# EasyEDA Pro project hand-watch-pcb.epro

# Schematic Schematic1
Board Name: Board1; Create Date: 2025-10-27; Page Name: P1; Project Name: stm32f411ceu6-hand-watch; Schematic Name: Schematic1; Update Date: 2025-10-27; BladeWidth: 10; Company: 嘉立创EDA; Page Size: A4; RegionStart: 1; ShowBorder: 1; TitleBlock: 1; TitleBlockPosition: 3; Version: V1.0; XRegionCount: 6; YRegionCount: 4
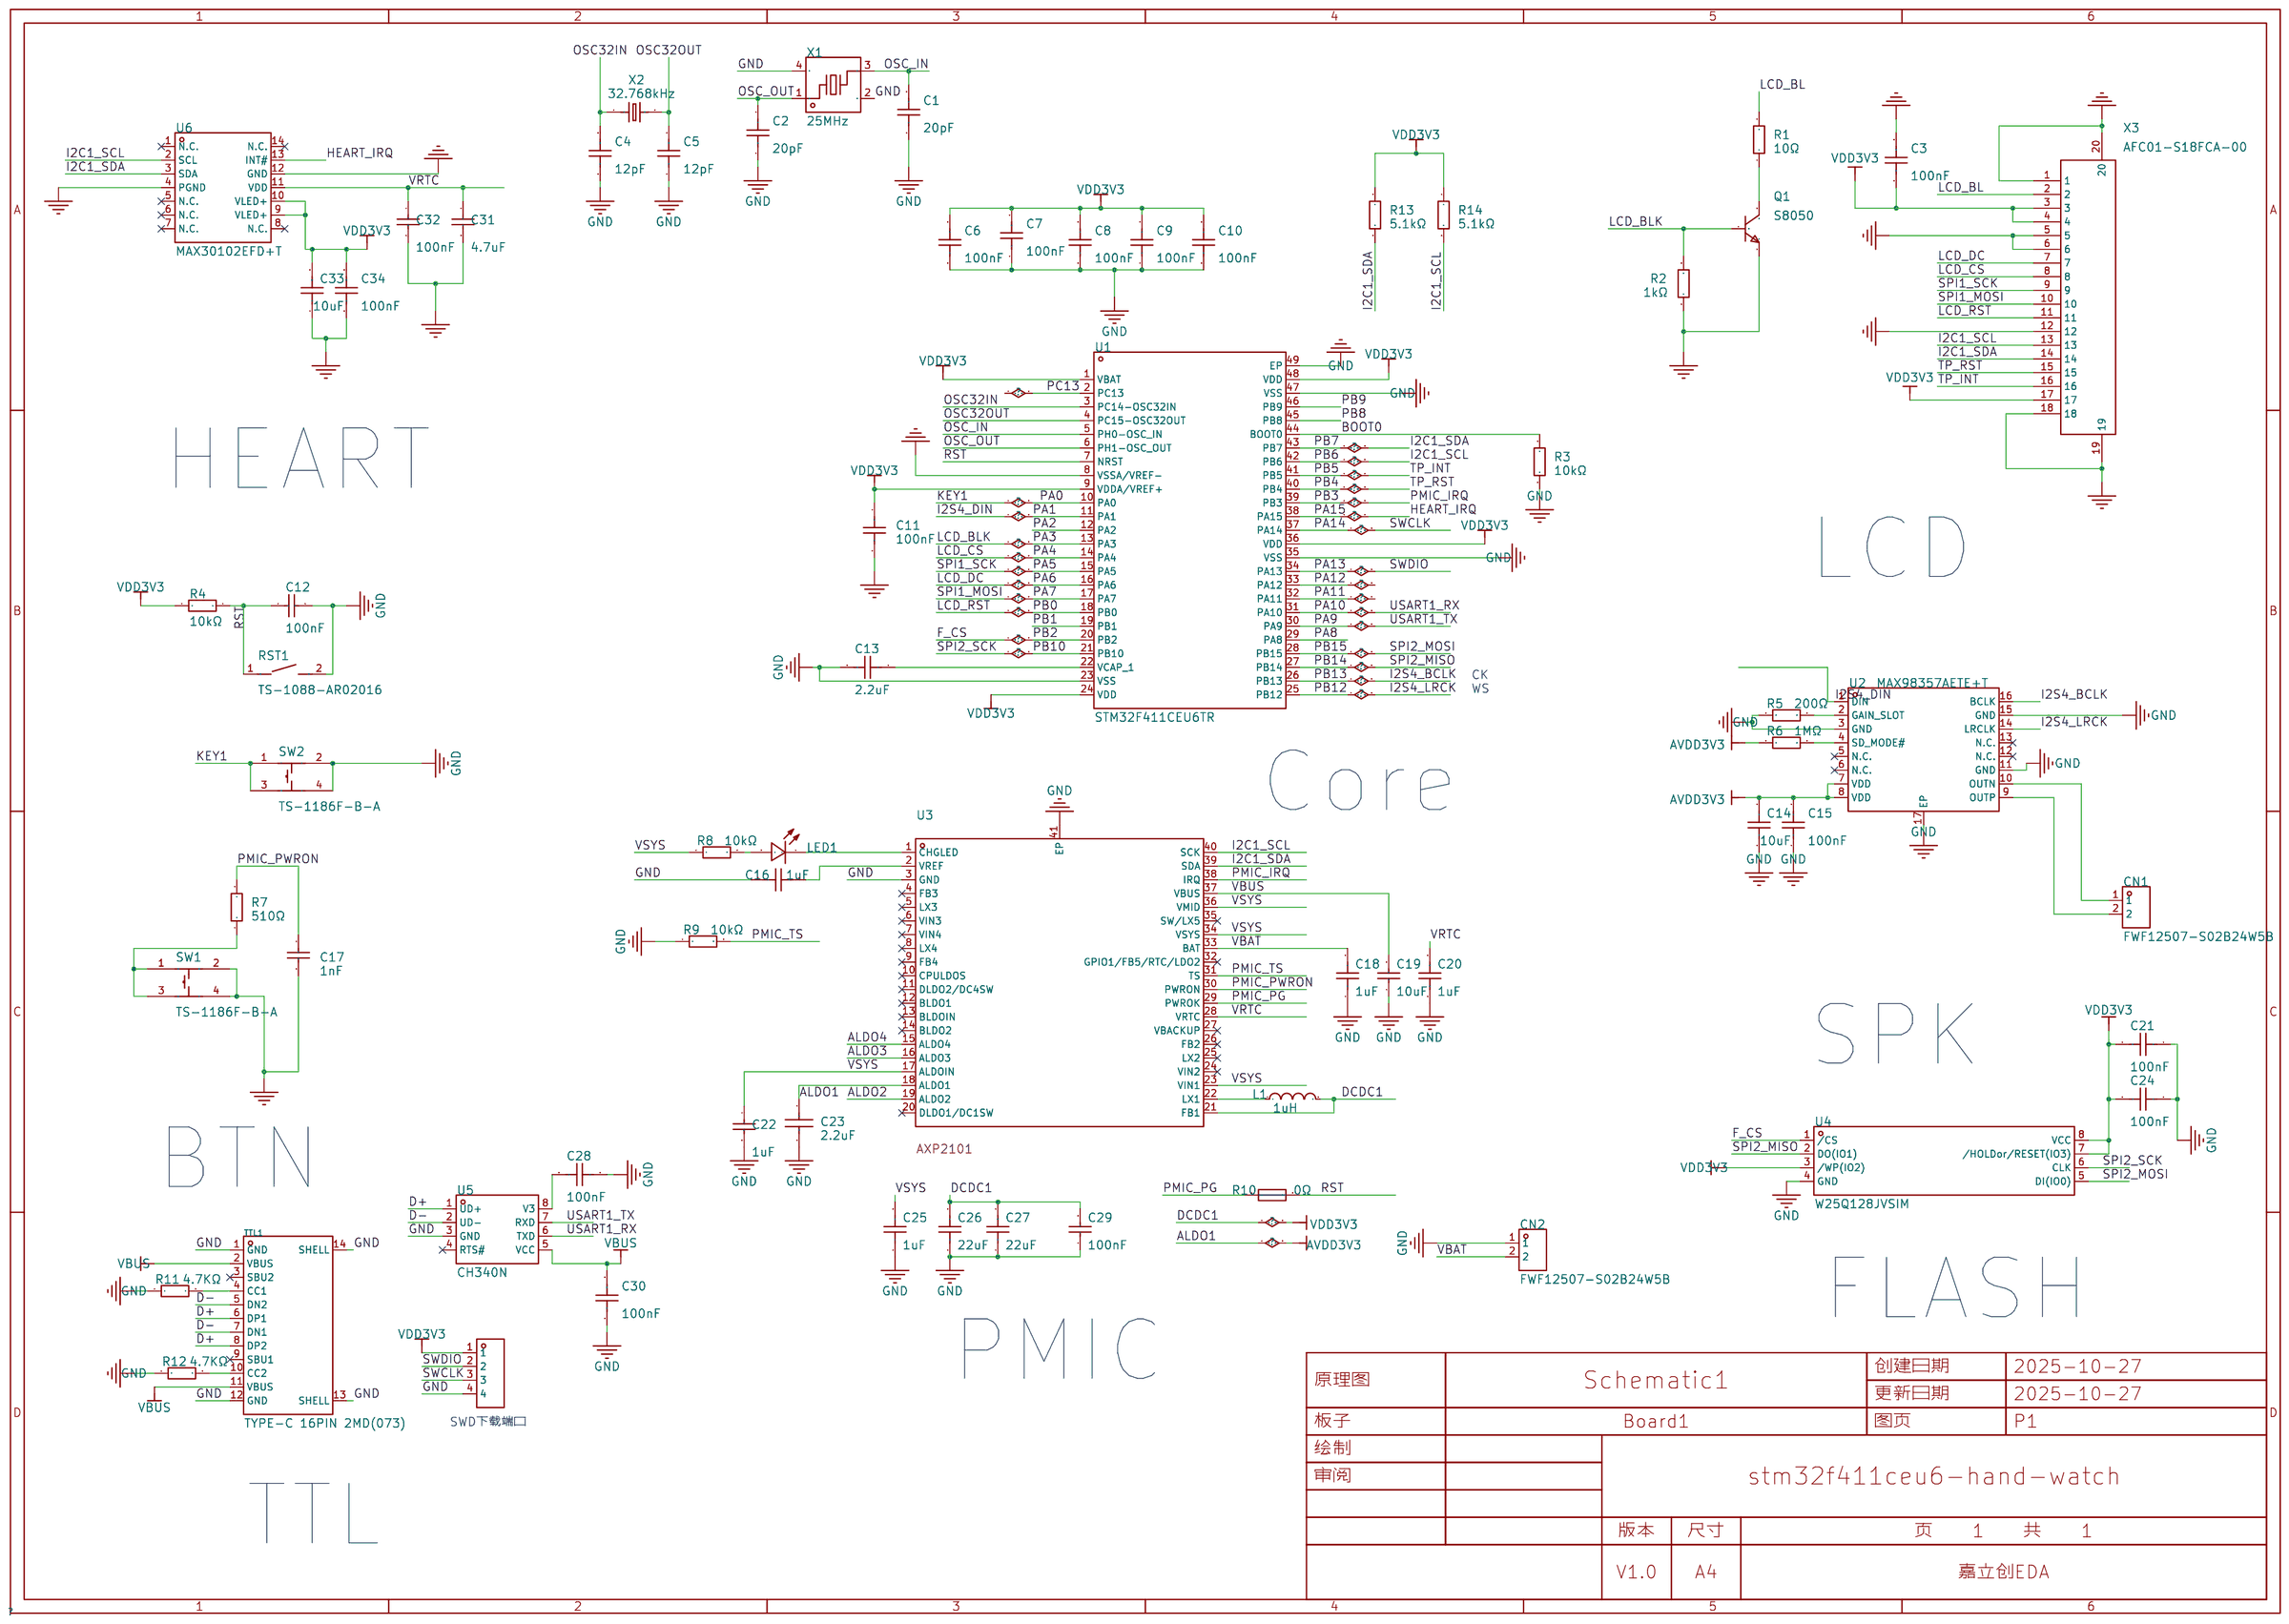
[diagram p0: schematic sheet]

## Parts
C1  20pF  [C0402]
C2  20pF  [C0402]
C3  100nF  [C0402]
C4  12pF  [C0402]
C5  12pF  [C0402]
C6  100nF  [C0402]
C7  100nF  [C0402]
C8  100nF  [C0402]
C9  100nF  [C0402]
C10  100nF  [C0402]
C11  100nF  [C0402]
C12  100nF  [C0402]
C13  2.2uF  [C0402]
C14  10uF  [C0603]
C15  100nF  [C0402]
C16  1uF  [C0402]
C17  1nF  [C0402]
C18  1uF  [C0402]
C19  10uF  [C0402]
C20  1uF  [C0402]
C21  100nF  [C0402]
C22  1uF  [C0402]
C23  2.2uF  [C0402]
C24  100nF  [C0402]
C25  1uF  [C0402]
C26  22uF  [C0603]
C27  22uF  [C0603]
C28  100nF  [C0402]
C29  100nF  [C0402]
C30  100nF  [C0402]
C31  4.7uF  [C0402]
C32  100nF  [C0402]
C33  10uF  [C0603]
C34  100nF  [C0402]
CN1  FWF12507-S02B24W5B  [CONN-TH_FWF12507-S02B24W5B]
CN2  FWF12507-S02B24W5B  [CONN-TH_FWF12507-S02B24W5B]
H1  PZ254R-11-04P  [HDR-TH_4P-P2.54-H-M-W10.4]
L1  1uH  [IND-SMD_L2.5-W2.0_WPN252012H]  (no BOM)
LED1  KT-0603R  [LED0603-RD]
Q1  S8050  [SOT-23-3_L2.9-W1.3-P1.90-LS2.3-BR]
R1  10Ω  [R0402]
R2  1kΩ  [R0402]
R3  10kΩ  [R0402]
R4  10kΩ  [R0402]
R5  200Ω  [R0402]
R6  1MΩ  [R0402]
R7  510Ω  [R0402]
R8  10kΩ  [R0402]
R9  10kΩ  [R0402]
R10  0Ω  [R0402]
R11  4.7KΩ  [R0402]
R12  4.7KΩ  [R0402]
R13  5.1kΩ  [R0402]
R14  5.1kΩ  [R0402]
RST1  TS-1088-AR02016  [SW-SMD_L3.9-W3.0-P4.45]
SW1  TS-1186F-B-A  [KEY-SMD_TS-1186F-C-A]
SW2  TS-1186F-B-A  [KEY-SMD_TS-1186F-C-A]
TTL1  TYPE-C 16PIN 2MD(073)  [USB-C-SMD_TYPE-C-6PIN-2MD-073]
U1  STM32F411CEU6TR  [UFQFPN-48_L7.0-W7.0-P0.50-BL-EP5.6]
U2  MAX98357AETE+T  [TQFN-16_L3.0-W3.0-P0.50-BL-EP1.5]
U3  -  [QFN-40_L5.0-W5.0-P0.40-TL-EP3.4]
U4  W25Q128JVSIM  [SOIC-8_L5.2-W5.2-P1.27-LS7.9-BL]
U5  CH340N  [SOP-8_L4.9-W3.9-P1.27-LS6.0-BL]
U6  MAX30102EFD+T  [OESIP-14_L5.6-W3.3-P0.80-TL]
X1  25MHz  [CRYSTAL-SMD_4P-L3.2-W2.5-BL]
X2  32.768kHz  [OSC-SMD_L3.2-W1.5]
X3  AFC01-S18FCA-00  [FPC-SMD_18P-P0.50_JS_AFC01-S18FCA-00]

## Library data of the parts
C1-C11 C13 C15 C21 C24 C28 C30 C34 = CAP_0402: Supplier Footprint: 0402
C12 C29 = CL05B104KO5NNNC: 容值:100nF;精度:±10%;额定电压:16V;材质(温度系数):X7R;; LCSC Part Name: 100nF ±10% 16V; Supplier Part: C1525; Manufacturer: SAMSUNG(三星); Supplier Footprint: 0402; JLCPCB Part Class: Basic Part; Datasheet: https://atta.szlcsc.com/upload/public/pdf/source/20160103/1457707674891.pdf; Supplier: LCSC; Tolerance: ±10%; Voltage Rated: 16V; Temperature Coefficient: X7R
C14 C33 = CAP_0603: Supplier Footprint: 0603
C16 C18 C20 C25 = CL05A105KA5NQNC: 容值:1uF;精度:±10%;额定电压:25V;材质(温度系数):X5R;; LCSC Part Name: 1uF ±10% 25V; Supplier Part: C52923; Manufacturer: SAMSUNG(三星); Supplier Footprint: 0402; JLCPCB Part Class: 基础库; Datasheet: https://atta.szlcsc.com/upload/public/pdf/source/20160103/1457707735223.pdf; Supplier: LCSC; Tolerance: ±10%; Voltage Rated: 25V; Temperature Coefficient: X5R
C17 = 0402B102K500NT: 容值:1nF;精度:±10%;额定电压:50V;材质(温度系数):X7R;; LCSC Part Name: 1nF ±10% 50V; Supplier Part: C1523; Manufacturer: FH(风华); Supplier Footprint: 0402; Datasheet: https://atta.szlcsc.com/upload/public/pdf/source/20200305/C486355_26A10D38EF8C2A5C37091D0039909270.pdf; Supplier: LCSC; Tolerance: ±10%; Voltage Rated: 50V; Temperature Coefficient: X7R
C19 = CL05A106MQ5NUNC: 容值:10uF;精度:±20%;额定电压:6.3V;材质(温度系数):X5R;; LCSC Part Name: 10uF ±20% 6.3V; Supplier Part: C15525; Manufacturer: SAMSUNG(三星); Supplier Footprint: 0402; JLCPCB Part Class: 基础库; Datasheet: https://atta.szlcsc.com/upload/public/pdf/source/20220823/2B02EE04F8F211D38A52DCB16EB6BEBA.pdf; Supplier: LCSC; Tolerance: ±20%; Voltage Rated: 6.3V; Temperature Coefficient: X5R
C22 = CL05B104KO5NNNC: 容值:100nF;精度:±10%;额定电压:16V;材质(温度系数):X7R;; LCSC Part Name: 100nF ±10% 16V; Supplier Part: C52923; Manufacturer: SAMSUNG(三星); Manufacturer Part: CL05A105KA5NQNC; Supplier Footprint: 0402; JLCPCB Part Class: Basic Part; Datasheet: https://atta.szlcsc.com/upload/public/pdf/source/20160103/1457707674891.pdf; Supplier: LCSC; Tolerance: ±10%; Voltage Rated: 16V; Temperature Coefficient: X7R; Check: true
C23 = CL05A225MQ5NSNC: 容值:2.2uF;精度:±20%;额定电压:6.3V;材质(温度系数):X5R;; LCSC Part Name: 2.2uF ±20% 6.3V; Supplier Part: C12530; Manufacturer: SAMSUNG(三星); Supplier Footprint: 0402; JLCPCB Part Class: 基础库; Datasheet: https://atta.szlcsc.com/upload/public/pdf/source/20160218/1457707763339.pdf; Supplier: LCSC; Tolerance: ±20%; Voltage Rated: 6.3V; Temperature Coefficient: X5R
C26 C27 = CL10A226MQ8NRNC: 容值:22uF;精度:±20%;额定电压:6.3V;材质(温度系数):X5R;; LCSC Part Name: 22uF ±20% 6.3V; Supplier Part: C59461; Manufacturer: SAMSUNG(三星); Supplier Footprint: 0603; JLCPCB Part Class: 基础库; Datasheet: https://atta.szlcsc.com/upload/public/pdf/source/20160103/1457707740762.pdf; Supplier: LCSC; Tolerance: ±20%; Voltage Rated: 6.3V; Temperature Coefficient: X5R
C31 C32 = CL05B104KO5NNNC: 容值:100nF;精度:±10%;额定电压:16V;材质(温度系数):X7R;; LCSC Part Name: 100nF ±10% 16V; Supplier Part: C1525; Manufacturer: SAMSUNG(三星); Manufacturer Part: CL05A105KA5NQNC; Supplier Footprint: 0402; JLCPCB Part Class: Basic Part; Datasheet: https://atta.szlcsc.com/upload/public/pdf/source/20160103/1457707674891.pdf; Supplier: LCSC; Tolerance: ±10%; Voltage Rated: 16V; Temperature Coefficient: X7R; Check: true
CN1 CN2 = FWF12507-S02B24W5B: 插针结构:1x2P;间距:1.25mm;安装方式:弯插;参考系列:-;总PIN数:2P;排数:1;每排PIN数:2;行距:-;额定电流:1A;工作温度范围:-25℃~+85℃;; Supplier Part: C2834209; Manufacturer: TXGA(特思嘉); Supplier Footprint: 弯插,P=1.25mm; JLCPCB Part Class: 扩展库; Datasheet: https://atta.szlcsc.com/upload/public/pdf/source/20210519/C2834209_D704536955647AE3B393E8393E63EA83.pdf; Supplier: LCSC; Pins Structure: 1x2P; Pitch: 1.25mm; Mounting Style: 弯插; Number of Pins: 2P; Number of Rows: 1; Number of PINs Per Row: 2; Current Rating (Max): 1A; Operating Temperature Range: -25℃~+85℃
H1 = PZ254R-11-04P: 间距:2.54mm;总PIN位数:4;排数:1;插针结构:1x4P;行距:-;安装类型:弯插;圆针/方针:方针;额定电流:-;额定电压:-;配合针长度:6mm;塑高:2.5mm;触头材质:黄铜;触头镀层:-;工作温度范围:-40℃~+105℃;颜色:黑色;; LCSC Part Name: 2.54mm 1x4P 弯插 方针; Supplier Part: C492412; Manufacturer: XFCN(兴飞); Supplier Footprint: 插件,P=2.54mm; JLCPCB Part Class: 扩展库; Supplier: LCSC; Pitch: 2.54mm; Number of Pins: 4; Number of Rows: 1; Pin Structure: 1x4P; Mounting Type: 弯插; Circluar Pins/Square Pins: 方针; Length of Mating Pin: 6mm; Insulation Height: 2.5mm; Contact Material: 黄铜; Operating Temperature Range: -40℃~+105℃; Color: 黑色
L1 = WPN252012H1R0MT: 电感值:1uH;精度:±20%;额定电流:3A;直流电阻(DCR):54mΩ;; LCSC Part Name: 1uH ±20% 3A 54mΩ; Supplier Part: C98348; Manufacturer: Sunlord(顺络); Supplier Footprint: SMD; JLCPCB Part Class: 扩展库; Datasheet: https://atta.szlcsc.com/upload/public/pdf/source/20210916/5D33DED32780FEB7D0AA8BED8FC93477.pdf; Supplier: LCSC; Tolerance: ±20%; Rated Current: 3A; DC Resistance (DCR): 54mΩ
LED1 = KT-0603R: 发光颜色:红色;功率:-;正向电流:-;主波长:-;二极管配置:-;透镜颜色:-;色温:-;发光角度:-;载带方式:-;工作温度:-40℃~+85℃;; LCSC Part Name: 0603 红灯 高亮; Supplier Part: C2286; Manufacturer: KENTO; Supplier Footprint: 0603; JLCPCB Part Class: 基础库; Datasheet: https://atta.szlcsc.com/upload/public/pdf/source/20160616/1466072038404.pdf; Supplier: LCSC; Emitted Color: 红色; Operating Temperature: -40℃~+85℃
Q1 = S8050_C20069125: 晶体管类型:NPN;集电极电流(Ic):500mA;集射极击穿电压(Vceo):25V;耗散功率(Pd):300mW;直流电流增益(hFE):120@50mA,1.0V;; LCSC Part Name: hFE:200-350，丝印:J3Y S8050; Supplier Part: C20069125; Manufacturer: 宏嘉诚; Supplier Footprint: SOT-23; JLCPCB Part Class: 扩展库; Datasheet: https://atta.szlcsc.com/upload/public/pdf/source/20250624/73EDA2AB79795B2EF6617BE5A1B52BD3.pdf; Supplier: LCSC; type: NPN; Current - Collector(Ic): 500mA; Collector - Emitter Voltage VCEO: 25V; Pd - Power Dissipation: 300mW; DC Current Gain: 120@50mA,1.0V; Transition frequency(fT): 100MHz; Current - Collector Cutoff: 100nA; Vce Saturation(VCE(sat)): 600mV@500mA,50mA; Operating Temperature: -55℃~+150℃; Emitter-Base Voltage(Vebo): 5V
R1 = 0402WGF100JTCE: 电阻类型:厚膜电阻;阻值:10Ω;精度:±1%;功率:62.5mW;温度系数:±200ppm/℃;; LCSC Part Name: 厚膜电阻 10Ω ±1% 62.5mW; Supplier Part: C25077; Manufacturer: UNI-ROYAL(厚声); Supplier Footprint: 0402; Datasheet: https://atta.szlcsc.com/upload/public/pdf/source/20200306/C422600_1E6D84923E4A46A82E41ADD87F860B5C.pdf; Supplier: LCSC; Type: 厚膜电阻; Tolerance: ±1%; Power(Watts): 62.5mW; Temperature Coefficient: ±200ppm/℃; Overload Voltage (Max): 50V; Operating Temperature Range: -55℃~+155℃; Check: true
R2 = 0402WGF1002TCE: 电阻类型:厚膜电阻;阻值:10kΩ;精度:±1%;功率:62.5mW;; LCSC Part Name: 10kΩ ±1% 62.5mW; Supplier Part: C25744; Manufacturer: UNI-ROYAL(厚声); Supplier Footprint: 0402; JLCPCB Part Class: 基础库; Datasheet: https://atta.szlcsc.com/upload/public/pdf/source/20200306/C422600_1E6D84923E4A46A82E41ADD87F860B5C.pdf; Supplier: LCSC; Type: 厚膜电阻; Tolerance: ±1%; Power(Watts): 62.5mW; Temperature Coefficient: ±100ppm/℃; Overload Voltage (Max): 50V; Operating Temperature Range: -55℃~+155℃; Check: true
R3-R6 R8 R9 R11-R14 = 0402WGF1002TCE: 电阻类型:厚膜电阻;阻值:10kΩ;精度:±1%;功率:62.5mW;; LCSC Part Name: 10kΩ ±1% 62.5mW; Supplier Part: C25744; Manufacturer: UNI-ROYAL(厚声); Supplier Footprint: 0402; JLCPCB Part Class: 基础库; Datasheet: https://atta.szlcsc.com/upload/public/pdf/source/20200306/C422600_1E6D84923E4A46A82E41ADD87F860B5C.pdf; Supplier: LCSC; Type: 厚膜电阻; Tolerance: ±1%; Power(Watts): 62.5mW; Temperature Coefficient: ±100ppm/℃; Overload Voltage (Max): 50V; Operating Temperature Range: -55℃~+155℃
R7 = 0402WGF5100TCE: 电阻类型:厚膜电阻;阻值:510Ω;精度:±1%;功率:62.5mW;最大工作电压:50V;温度系数:±100ppm/℃;; LCSC Part Name: 510Ω ±1% 62.5mW 厚膜电阻; Supplier Part: C25123; Manufacturer: UNI-ROYAL(厚声); Supplier Footprint: 0402; JLCPCB Part Class: 基础库; Datasheet: https://atta.szlcsc.com/upload/public/pdf/source/20200306/C422600_1E6D84923E4A46A82E41ADD87F860B5C.pdf; Supplier: LCSC; Type: 厚膜电阻; Tolerance: ±1%; Power(Watts): 62.5mW; Overload Voltage (Max): 50V; Temperature Coefficient: ±100ppm/℃; Operating Temperature Range: -55℃~+155℃
R10 = 0402WGF0000TCE: 电阻类型:厚膜电阻;阻值:0Ω;精度:±1%;功率:62.5mW;; LCSC Part Name: 0Ω ±1% 62.5mW; Supplier Part: C17168; Manufacturer: UNI-ROYAL(厚声); Supplier Footprint: 0402; Datasheet: https://atta.szlcsc.com/upload/public/pdf/source/20200306/C422600_1E6D84923E4A46A82E41ADD87F860B5C.pdf; Supplier: LCSC; Type: 厚膜电阻; Tolerance: ±1%; Power(Watts): 62.5mW; Temperature Coefficient: ±800ppm/℃; Overload Voltage (Max): 50V; Operating Temperature Range: -55℃~+155℃
RST1 = TS-1088-AR02016: 电路结构:单刀单掷;按钮形状:圆形按钮;作用力:160gf;安装方式:立贴;开关长度:4mm;开关宽度:3mm;开关高度:2mm;带支架:不带;触点电流:50mA;额定电压(DC):12V;绝缘电阻:100MΩ;机械寿命:10万次;; LCSC Part Name: 4*3*2mm 立贴 轻触开关; Supplier Part: C720477; Manufacturer: XUNPU(讯普); Supplier Footprint: SMD; JLCPCB Part Class: 基础库; Datasheet: https://atta.szlcsc.com/upload/public/pdf/source/20200810/C720475_60D09DD6C54279ADDB2DC25100F1CC11.pdf; Supplier: LCSC; Circuit: 单刀单掷; Actuator Style: 圆形按钮; Operating Force: 160gf; Mounting Style: 立贴; Switch Length: 4mm; Switch Width: 3mm; Switch Height: 2mm; Strike Gundam: 不带; Contact Current: 50mA; Voltage Rating (DC): 12V; Insulation Resistance: 100MΩ; Actuator/Cap Color: 黑色; Pin Style: SMD接片; Mechanical Life: 10万次; Operating Temperature: -30℃~+80℃
SW1 SW2 = TS-1186F-B-A: 电路结构:单刀单掷;按钮形状:矩形按钮;作用力:1.6N;安装方式:卧贴;开关长度:3.6mm;开关宽度:3.5mm;开关高度:3.6mm;带支架:不带支架;触点电流:50mA;额定电压:12V;带灯:无;工作寿命:10万次;; LCSC Part Name: 3.6*3.5*3.6mm 卧贴 轻触开关; Supplier Part: C908470; Manufacturer: XKB Connection(中国星坤); Supplier Footprint: SMD; Datasheet: https://item.szlcsc.com/datasheet/TS-1186F-B-A/975211.html; Supplier: LCSC; Circuit: 单刀单掷; Actuator Style: 矩形按钮; Operating Force: 1.6N; Mounting Type: 卧贴; Length: 3.6mm; Width: 3.5mm; Switch Height: 3.6mm; with Bracket: 不带支架; Contact Current: 50mA; Voltage Rating: 12V; Actuator/Cap Color: 黑色; With Lamp: 无; Life: 10万次; Operating Temperature: -30℃~+85℃
TTL1 = TYPE-C 16PIN 2MD(073): 连接器类型:Type-C;标准:-;公母:母座;触点数量:16;端口数量:1;安装方式:卧贴;额定电流 - 电源:5A;工作温度范围:-25℃~+85℃;; LCSC Part Name: TYPE-C母座 16P 4脚插件带定位柱 不锈钢外壳 2次模顶; Supplier Part: C2765186; Manufacturer: SHOU HAN(首韩); Supplier Footprint: SMD; JLCPCB Part Class: 扩展库; Supplier: LCSC; Connector Type: Type-C; Gender: 母座; Number of Contacts: 16; Number of Ports: 1; Mounting Style: 卧贴; Current Rating - Power (Max): 5A; Operating Temperature Range: -25℃~+85℃
U1 = STM32F411CEU6TR: CPU内核:ARM-M4;CPU最大主频:100MHz;应用领域:-;; LCSC Part Name: 带DSP和FPU的高性能基本型系列ARM Cortex-M4 MCU，具有512 KB Flash、100 MHz CPU和ART加速器; Supplier Part: C2054095; Manufacturer: ST(意法半导体); Supplier Footprint: UFQFPN-48(7x7); Datasheet: https://atta.szlcsc.com/upload/public/pdf/source/20210609/C2054095_D420176800F9A9DECA745BDC6F5392BE.pdf; Supplier: LCSC; CPU Core: ARM-M4; CPU Maximum Speed: 100MHz; Program Storage Size: 512KB; Program Memory Type: FLASH; Number of I/O: 36; ADC (Bit): 12bit; Voltage - Supply: 1.7V~3.6V
U2 = MAX98357AETE+T: 功放类型:-;扬声器通道数:单声道;输出功率:3.2Wx2@4Ω;; Supplier Part: C910544; Manufacturer: ADI(亚德诺)/MAXIM(美信); Supplier Footprint: TQFN-16-EP(3x3); JLCPCB Part Class: 扩展库; Datasheet: https://atta.szlcsc.com/upload/public/pdf/source/20210106/C910544_CB6DE4B2CEE254A72E6BDB40E718D281.pdf; Supplier: LCSC; Speaker Channels: 单声道; Output Power: 3.2Wx2@4Ω; Supply Voltage: 2.5V~5.5V; Operating Temperature: -40℃~+85℃
U3 = AXP2101: Supplier Part: C3036461; Manufacturer: Allwinner(全志); Supplier Footprint: QFN-40; Datasheet: https://atta.szlcsc.comnull; Supplier: LCSC
U4 = W25Q128JVSIM: Supplier Part: C2613930; Manufacturer: WINBOND(华邦); Supplier Footprint: SOIC-8-208mil; JLCPCB Part Class: Extended Part; Datasheet: https://atta.szlcsc.com/upload/public/pdf/source/20210412/84C68860639CE6E99E4DBE9DB39E5296.pdf; Supplier: LCSC
U5 = CH340N: LCSC Part Name: USB转串口芯片 CH340; Supplier Part: C2977777; Manufacturer: WCH(南京沁恒); Supplier Footprint: SOP-8; JLCPCB Part Class: 扩展库; Datasheet: https://atta.szlcsc.com/upload/public/pdf/source/20230530/6E401E9554E9F5311886CC8B3F89B62E.pdf; Supplier: LCSC
U6 = MAX30102EFD+T_C6454833: 用于可穿戴健康设备的高灵敏度脉搏血氧仪和心率传感器、用于健身和卫生保健领域的高灵敏度脉搏血氧仪和心率生物传感器; LCSC Part Name: 高灵敏度脉搏血氧仪和心率传感器; Supplier Part: C6454833; Manufacturer: ADI(亚德诺)/MAXIM(美信); Supplier Footprint: OESIP-14; JLCPCB Part Class: 扩展库; Datasheet: https://atta.szlcsc.com/upload/public/pdf/source/20230523/5357A0E2EBB238F1082B332F3131EA1A.pdf; Supplier: LCSC; Operating Temperature: -40℃~+85℃
X1 = XL2EL89CSI-111YLC-25M: 频率:25MHz;频率公差:±10ppm;负载电容:20pF;; LCSC Part Name: 25MHz ±10ppm 20pF YSX321SL; Supplier Part: C5280577; Manufacturer: YXC(扬兴晶振); Supplier Footprint: SMD3225-4P; JLCPCB Part Class: 扩展库; Datasheet: https://atta.szlcsc.com/upload/public/pdf/source/20221123/8DAA01809C4E3F159850A71277C18D74.pdf; Supplier: LCSC; Crystal Type: 贴片无源晶振; Frequency Tolerance: ±10ppm; Load Capacitance: 20pF
X2 = X321532768KGD2SI: 频率:32.768kHz;频率公差:±20ppm;负载电容:12.5pF;; LCSC Part Name: 32.768kHz ±20ppm 12.5pF YST310S; Supplier Part: C620155; Manufacturer: YXC(扬兴晶振); Supplier Footprint: SMD3215-2P; JLCPCB Part Class: Extended Part; Datasheet: https://atta.szlcsc.com/upload/public/pdf/source/20210329/C620155_E5A74FC0D27C5E9015A8D75DE9484FEA.pdf; Supplier: LCSC; Crystal Type: 贴片无源晶振; Frequency Tolerance: ±20ppm; Load Capacitance: 12.5pF; Operating Temperature: -40℃~+85℃
X3 = AFC01-S18FCA-00: 锁定特性:翻盖式;触点类型:下接;触点数量:18P;间距:0.5mm;安装类型:卧贴;工作温度范围:-;; LCSC Part Name: 间距:0.5mm P数:18P 翻盖式 下接; Supplier Part: C262666; Manufacturer: JS(钜硕电子); Supplier Footprint: SMD,P=0.5mm,卧贴; Datasheet: https://atta.szlcsc.com/upload/public/pdf/source/20190816/C413942_2A72D1AC756EAE17EEDF756A339D4500.pdf; Supplier: LCSC; Locking Feature: 翻盖式; Contact Type: 下接; Number of Contacts: 18P; Pitch: 0.5mm; Mounting Type: 卧贴; FFC, FCB Thickness: 0.3mm; Height Above Board: 2mm

## Nets
AVDD3V3: C14.2 C15.2 C23.2 R6.1 U2.7(VDD) U2.8(VDD) U3.18(ALDO1)
GND: C1.1 C2.1 C3.2 C4.1 C5.1 C6.1 C7.1 C8.1 C9.1 C10.1 C11.2 C12.1 C13.2 C14.1 C15.1 C16.1 C17.1 C18.1 C19.1 C20.1 C21.1 C22.2 C23.1 C24.1 C25.1 C26.1 C27.1 C28.1 C29.1 C30.1 C31.2 C32.2 C33.1 C34.1 CN2.1 H1.4 Q1.2(E) R2.1 R3.2 R5.1 R9.1 R11.1 R12.1 RST1.2 SW1.2 SW1.4 SW2.2 SW2.4 TTL1.1(GND) TTL1.12(GND) TTL1.13(SHELL) TTL1.14(SHELL) U1.8(VSSA/VREF-) U1.23(VSS) U1.35(VSS) U1.47(VSS) U1.49(EP) U2.3(GND) U2.11(GND) U2.15(GND) U2.17(EP) U3.3(GND) U3.41(EP) U4.4(GND) U5.3(GND) U6.4(PGND) U6.12(GND) X1.2(GND) X1.4(GND) X3.1 X3.5 X3.6 X3.12 X3.18 X3.19 X3.20
VBAT: C18.2 CN2.2 U3.33(BAT)
VBUS: C19.2 C30.2 TTL1.2(VBUS) TTL1.11(VBUS) U3.37(VBUS) U5.5(VCC)
VDD3V3: C3.1 C6.2 C7.2 C8.2 C9.2 C10.2 C11.1 C21.2 C24.2 C26.2 C27.2 C29.2 C33.2 C34.2 H1.1 L1.2 R4.2 R13.1 R14.1 U1.1(VBAT) U1.9(VDDA/VREF+) U1.24(VDD) U1.36(VDD) U1.48(VDD) U3.21(FB1) U4.3(/WP(IO2)) U4.7(/HOLDor/RESET(IO3)) U4.8(VCC) U6.9(VLED+) U6.10(VLED+) X3.3 X3.4 X3.17
ALDO2: U3.19(ALDO2)
ALDO3: U3.16(ALDO3)
ALDO4: U3.15(ALDO4)
BOOT0: R3.1 U1.44(BOOT0)
D+: TTL1.6(DP1) TTL1.8(DP2) U5.1(UD+)
D-: TTL1.5(DN2) TTL1.7(DN1) U5.2(UD-)
F_CS: U1.20(PB2) U4.1(/CS)
HEART_IRQ: U1.38(PA15) U6.13(INT#)
I2C1_SCL: R14.2 U1.42(PB6) U3.40(SCK) U6.2(SCL) X3.13
I2C1_SDA: R13.2 U1.43(PB7) U3.39(SDA) U6.3(SDA) X3.14
I2S4_BCLK: U1.26(PB13) U2.16(BCLK)
I2S4_DIN: U1.11(PA1) U2.1(DIN)
I2S4_LRCK: U1.25(PB12) U2.14(LRCLK)
KEY1: SW2.1 SW2.3 U1.10(PA0)
LCD_BL: R1.2 X3.2
LCD_BLK: Q1.1(B) R2.2 U1.13(PA3)
LCD_CS: U1.14(PA4) X3.8
LCD_DC: U1.16(PA6) X3.7
LCD_RST: U1.18(PB0) X3.11
OSC32IN: C4.2 U1.3(PC14-OSC32IN) X2.1
OSC32OUT: C5.2 U1.4(PC15-OSC32OUT) X2.2
OSC_IN: C1.2 U1.5(PH0-OSC_IN) X1.3
OSC_OUT: C2.2 U1.6(PH1-OSC_OUT) X1.1
PA2: U1.12(PA2)
PA5: U1.15(PA5) X3.9
PA7: U1.17(PA7) X3.10
PA8: U1.29(PA8)
PA9: U1.30(PA9) U5.7(RXD)
PA10: U1.31(PA10) U5.6(TXD)
PA11: U1.32(PA11)
PA12: U1.33(PA12)
PA13: H1.2 U1.34(PA13)
PA14: H1.3 U1.37(PA14)
PB1: U1.19(PB1)
PB3: U1.39(PB3) U3.38(IRQ)
PB4: U1.40(PB4) X3.15
PB5: U1.41(PB5) X3.16
PB8: U1.45(PB8)
PB9: U1.46(PB9)
PB10: U1.21(PB10) U4.6(CLK)
PB14: U1.27(PB14) U4.2(DO(IO1))
PB15: U1.28(PB15) U4.5(DI(IO0))
PC13: U1.2(PC13)
PMIC_PG: R10.1 U3.29(PWROK)
PMIC_PWRON: C17.2 R7.2 U3.30(PWRON)
PMIC_TS: R9.2 U3.31(TS)
RST: C12.2 R4.1 R10.2 RST1.1 U1.7(NRST)
VRTC: C20.2 C31.1 C32.1 U3.28(VRTC) U6.11(VDD)
VSYS: C22.1 C25.2 R8.1 U3.17(ALDOIN) U3.23(VIN1) U3.34(VSYS) U3.36(VMID)
$1N3644: C28.2 U5.8(V3)
$1N3653: R11.2 TTL1.4(CC1)
$1N3654: R12.2 TTL1.10(CC2)
$1N3730: R5.2 U2.2(GAIN_SLOT)
$1N3744: CN1.1 U2.10(OUTN)
$1N3745: CN1.2 U2.9(OUTP)
$1N3746: R6.2 U2.4(SD_MODE#)
$1N3823: C13.1 U1.22(VCAP_1)
$1N4450: Q1.3(C) R1.1
$1N5317: LED1.1(K) U3.1(CHGLED)
$1N5318: LED1.2(A) R8.2
$1N5323: C16.2 U3.2(VREF)
$1N5350: L1.1 U3.22(LX1)
Net-(R7-1): R7.1 SW1.1 SW1.3

Not connected (* = marked no-connect by the designer): TTL1 3(SBU2)* 9(SBU1)*; U2 5(N.C.)* 6(N.C.)* 12(N.C.)* 13(N.C.)*; U3 4(FB3)* 5(LX3)* 6(VIN3)* 7(VIN4)* 8(LX4)* 9(FB4)* 10(CPULDOS)* 11(DLDO2/DC4SW)* 12(BLDO1)* 13(BLDOIN)* 14(BLDO2)* 20(DLDO1/DC1SW)* 24(VIN2)* 25(LX2)* 26(FB2)* 27(VBACKUP)* 32(GPIO1/FB5/RTC/LDO2)* 35(SW/LX5)*; U5 4(RTS#)*; U6 1(N.C.)* 5(N.C.)* 6(N.C.)* 7(N.C.)* 8(N.C.)* 14(N.C.)*

## Notes on the sheet
- HEART
- LCD
- CK
- WS
- Core
- SPK
- BTN
- FLASH
- PMIC
- SWD下载端口
- TTL

# Board PCB1
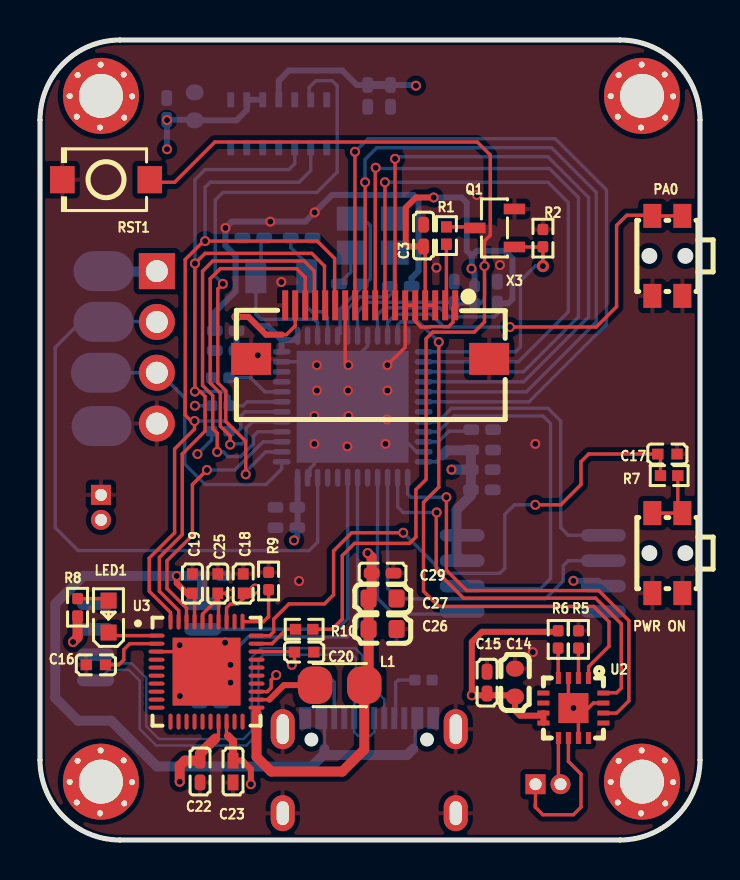
[diagram p1: board, top side]
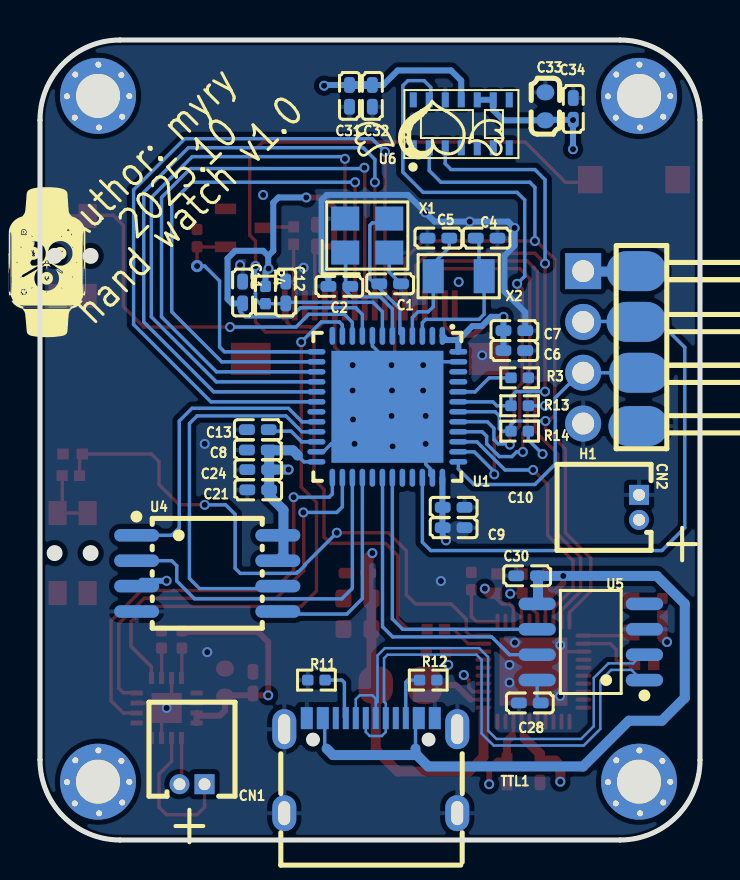
[diagram p2: board, bottom side, seen from below]

Outline 33 x 40 mm; copper layers: Top Layer, SIG, GND, Bottom Layer. Coordinates in mm from the lower left corner of the outline.
Outline path: 0,36 0,4 arc(1.17,1.17) 4,0 29,0 arc(31.83,1.17) 33,4 33,36 arc(31.83,38.83) 29,40 4,40 arc(1.17,38.83) 0,36
Stack: Top Layer 0.035mm 外层铜厚1oz / Dielectric1 0.2104mm 7628 RC49% 8.6mil / SIG 0.0152mm 内层铜厚 / Dielectric2 1.065mm 1.1mm H/HOZ Copper / GND 0.0152mm 内层铜厚 / Dielectric3 0.2104mm 7628 RC49% 8.6mil / Bottom Layer 0.035mm 外层铜厚1oz

## Design rules (mm)
net D-: DP1
net D+: DP1
spacing copperThickness1oz (default): track to track 0.102, other pairs 0.152 to 0.3
spacing copperThickness2oz: track to track 0.203, other pairs 0.152 to 0.3
spacing Plane_innerPlane: track to track 0.102, other pairs 0.152 to 0.3
spacing Copper_copperRegion: track to track 0.102, other pairs 0.152 to 0.3
track width copperThickness1oz (default): min 0.127, default 0.17, max 2.54
track width copperThickness2oz: min 0.203, default 0.254, max 2.54
differential pair differentialPair (default): width min 0.124, default 0.124, max 0.124; gap min 0.203, default 0.203
pour e859 uses Copper_copperRegion
pour e948 uses Copper_copperRegion
pour e1036 uses Copper_copperRegion
pour e1055 uses Copper_copperRegion

## Placement (name value [footprint] x y rotation side)
C1  20pF  [C0402#2]  15.49 27.81 0 bottom
C2  20pF  [C0402#2]  18.03 27.68 180 bottom
C3  100nF  [C0402#2]  19.18 30.22 90 top
C4  12pF  [C0402#2]  10.67 30.09 0 bottom
C5  12pF  [C0402#2]  13.08 30.09 180 bottom
C6  100nF  [C0402#2]  9.28 24.47 0 bottom
C7  100nF  [C0402#2]  9.28 25.47 0 bottom
C8  100nF  [C0402#2]  22.11 19.5 180 bottom
C9  100nF  [C0402#2]  12.32 15.62 0 bottom
C10  100nF  [C0402#2]  12.32 16.63 0 bottom
C11  100nF  [C0402#2]  22.87 27.38 90 bottom
C12  100nF  [C0402#2]  20.71 27.38 270 bottom
C13  2.2uF  [C0402#2]  22.11 20.52 0 bottom
C14  10uF  [C0603]  23.75 7.87 270 top
C15  100nF  [C0402#2]  22.35 7.87 270 top
C16  1uF  [C0402]  2.79 8.76 0 top
C17  1nF  [C0402]  31.37 19.3 180 top
C18  1uF  [C0402]  10.16 12.82 270 top
C19  10uF  [C0402]  7.62 12.82 270 top
C20  1uF  [C0402]  13.21 9.39 180 top
C21  100nF  [C0402#2]  22.09 17.51 180 bottom
C22  1uF  [C0402#2]  8 3.42 270 top
C23  2.2uF  [C0402#3]  9.65 3.42 90 top
C24  100nF  [C0402#2]  22.09 18.52 180 bottom
C25  1uF  [C0402]  8.89 12.82 270 top
C26  22uF  [C0603]  17.13 10.55 180 top
C27  22uF  [C0603]  17.13 12.07 180 top
C28  100nF  [C0402#2]  8.51 6.85 180 bottom
C29  100nF  [C0402#2]  17.13 13.34 180 top
C30  100nF  [C0402#2]  8.64 13.21 180 bottom
C31  4.7uF  [C0402#2]  17.53 37.21 270 bottom
C32  100nF  [C0402#2]  16.38 37.21 270 bottom
C33  10uF  [C0603]  7.73 36.68 270 bottom
C34  100nF  [C0402#2]  6.34 36.56 270 bottom
CN1  FWF12507-S02B24W5B  [CONN-TH_FWF12507-S02B24W5B]  25.4 2.79 0 bottom
CN2  FWF12507-S02B24W5B  [CONN-TH_FWF12507-S02B24W5B]  3.05 16.63 270 bottom
H1  PZ254R-11-04P  [HDR-TH_4P-P2.54-H-M-W10.4]  5.84 24.63 90 bottom
L1  1uH  [IND-SMD_L2.5-W2.0_WPN252012H]  14.99 7.74 180 top
LED1  KT-0603R  [LED0603-RD]  3.43 11.17 90 top
NOREF  -  [Pad_e108]  1.84 1.88 0 top
NOREF#2  -  [Pad_e76]  4.6 37.18 0 top
NOREF#3  -  [Pad_e105]  1.88 3.96 0 top
NOREF#4  -  [Pad_e97]  31.23 3.98 0 top
NOREF#5  -  [Pad_e103]  3.05 2.92 0 top
NOREF#6  -  [Pad_e112]  3.08 20.7 90 top
NOREF#7  -  [Pad_e102]  3 1.33 0 top
NOREF#8  -  [Pad_e106]  4.18 3.98 0 top
NOREF#9  -  [Pad_e91]  30.08 4.48 0 top
NOREF#10  -  [Pad_e107]  4.21 1.83 0 top
NOREF#11  -  [Pad_e78]  3 35.62 0 top
NOREF#12  -  [Pad_e98]  31.26 1.83 0 top
NOREF#13  -  [Pad_e104]  1.48 2.91 0 top
NOREF#14  -  [Pad_e86]  28.54 37.2 0 top
NOREF#15  -  [Pad_e90]  28.89 36.17 0 top
NOREF#16  -  [Pad_e83]  31.65 37.18 0 top
NOREF#17  -  [Pad_e77]  4.21 36.12 0 top
NOREF#18  -  [Pad_e110]  3.17 25.91 90 top
NOREF#19  -  [Pad_e92]  31.65 2.89 0 top
NOREF#20  -  [Pad_e84]  30.05 35.62 0 top
NOREF#21  -  [Pad_e93]  30.05 1.33 0 top
NOREF#22  -  [Pad_e94]  30.1 2.92 0 top
NOREF#23  -  [Pad_e89]  31.26 36.12 0 top
NOREF#24  -  [Pad_e79]  1.84 36.17 0 top
NOREF#25  -  [Pad_e88]  31.23 38.27 0 top
NOREF#26  -  [Pad_e81]  1.88 38.25 0 top
NOREF#27  -  [Pad_e100]  3.03 4.48 0 top
NOREF#28  -  [Pad_e73]  3.05 37.21 0 top
NOREF#29  -  [Pad_e111]  3.05 23.36 90 top
NOREF#30  -  [Pad_e82]  30.08 38.77 0 top
NOREF#31  -  [Pad_e74]  3.03 38.77 0 top
NOREF#32  -  [Pad_e109]  3.17 28.44 90 top
NOREF#33  -  [Pad_e99]  28.89 1.88 0 top
NOREF#34  -  [Pad_e80]  1.48 37.2 0 top
NOREF#35  -  [Pad_e101]  4.6 2.89 0 top
NOREF#36  -  [Pad_e75]  4.18 38.27 0 top
NOREF#37  -  [Pad_e95]  28.54 2.91 0 top
NOREF#38  -  [Pad_e96]  28.93 3.96 0 top
NOREF#39  -  [Pad_e87]  28.93 38.25 0 top
NOREF#40  -  [Pad_e85]  30.1 37.21 0 top
PA0  TS-1186F-B-A  [KEY-SMD_TS-1186F-C-A]  31.37 29.21 270 top
PWR ON  TS-1186F-B-A  [KEY-SMD_TS-1186F-C-A]  31.37 14.35 270 top
Q1  S8050  [SOT-23-3_L2.9-W1.3-P1.90-LS2.3-BR]  22.73 30.6 0 top
R1  10Ω  [R0402]  20.32 30.22 270 top
R2  1kΩ  [R0402#2]  25.15 30.09 270 top
R3  10kΩ  [R0402#2]  9.02 23.11 180 bottom
R4  10kΩ  [R0402#2]  21.73 27.25 90 bottom
R5  200Ω  [R0402#2]  26.92 10.03 270 top
R6  1MΩ  [R0402#2]  25.91 10.03 270 top
R7  510Ω  [R0402]  31.46 18.22 180 top
R8  10kΩ  [R0402#2]  1.88 11.64 90 top
R9  10kΩ  [R0402#2]  11.43 12.95 270 top
R10  0Ω  [R0402]  13.21 10.54 0 top
R11  4.7KΩ  [R0402#2]  19.18 8 180 bottom
R12  4.7KΩ  [R0402#2]  13.59 8 0 bottom
R13  5.1kΩ  [R0402#2]  9.02 21.71 0 bottom
R14  5.1kΩ  [R0402#2]  9.02 20.44 0 bottom
RST1  TS-1088-AR02016  [SW-SMD_L3.9-W3.0-P4.45]  3.3 33.02 180 top
TTL1  TYPE-C 16PIN 2MD(073)  [USB-C-SMD_TYPE-C-6PIN-2MD-073]  16.46 3.72 180 bottom
U1  STM32F411CEU6TR  [UFQFPN-48_L7.0-W7.0-P0.50-BL-EP5.6]  15.63 21.66 0 bottom
U2  MAX98357AETE+T  [TQFN-16_L3.0-W3.0-P0.50-BL-EP1.5]  26.67 6.6 180 top
U3  -  [QFN-40_L5.0-W5.0-P0.40-TL-EP3.4]  8.33 8.42 0 top
U4  W25Q128JVSIM  [SOIC-8_L5.2-W5.2-P1.27-LS7.9-BL]  24.64 13.33 270 bottom
U5  CH340N  [SOP-8_L4.9-W3.9-P1.27-LS6.0-BL]  5.46 9.9 90 bottom
U6  MAX30102EFD+T  [OESIP-14_L5.6-W3.3-P0.80-TL]  11.94 35.81 90 bottom
X1  25MHz  [CRYSTAL-SMD_4P-L3.2-W2.5-BL]  16.64 30.22 180 bottom
X2  32.768kHz  [OSC-SMD_L3.2-W1.5]  12.06 28.19 0 bottom
X3  AFC01-S18FCA-00  [FPC-SMD_18P-P0.50_JS_AFC01-S18FCA-00]  16.51 25.4 0 top

## Footprints (pads in the part's own frame, mm; a bottom-side part is the same pattern mirrored in y, then rotated)
C0402
  rect 0.566x0.54 smd: 1(-0.481,0) 2(0.481,0)
C0402#2
  rrect 0.79x0.54 smd: 1(-0.545,0) 2(0.545,0)
C0402#3
  rect 0.79x0.54 smd: 1(-0.545,0) 2(0.545,0)
C0603
  rrect 0.8x0.9 smd: 1(-0.7,0) 2(0.7,0)
CONN-TH_FWF12507-S02B24W5B
  rect 1x1 hole 0.6: 1(-0.625,0)
  round 1 hole 0.6: 2(0.625,0)
CRYSTAL-SMD_4P-L3.2-W2.5-BL
  rect 1.4x1.2 smd: 1(-1.1,-0.85) 2(1.1,-0.85) 3(1.1,0.85) 4(-1.1,0.85)
FPC-SMD_18P-P0.50_JS_AFC01-S18FCA-00
  rect 0.3x1.5 smd: 1(4.25,1.339) 2(3.751,1.339) 3(3.25,1.339) 4(2.749,1.339) 5(2.249,1.339) 6(1.749,1.339) 7(1.248,1.339) 8(0.75,1.339) 9(0.251,1.339) 10(-0.25,1.339) 11(-0.75,1.339) 12(-1.251,1.339) 13(-1.751,1.339) 14(-2.251,1.339) 15(-2.751,1.339) 16(-3.25,1.339) 17(-3.75,1.339) 18(-4.25,1.339)
  rect 2x1.6 smd: 19(-5.949,-1.339) 20(5.949,-1.339)
HDR-TH_4P-P2.54-H-M-W10.4
  rect 1.8x1.8 hole 1.1: 1(3.81,0)
  round 1.8 hole 1.1: 2(1.27,0) 3(-1.27,0) 4(-3.81,0)
IND-SMD_L2.5-W2.0_WPN252012H
  rrect 1.724x1.87 smd: 1(1.228,0) 2(-1.228,0)
KEY-SMD_TS-1186F-C-A
  rect 1.2x0.9 smd: 1(-2,0.75) 2(2,0.75) 3(-2,-0.75) 4(2,-0.75)
LED0603-RD
  rect 0.8x0.8 smd: 1(-0.799,0) 2(0.799,0)
OESIP-14_L5.6-W3.3-P0.80-TL
  rect 0.75x0.35 smd: 1(-1.2,2.4) 2(-1.2,1.6) 3(-1.2,0.8) 4(-1.2,0) 5(-1.2,-0.8) 6(-1.2,-1.6) 7(-1.2,-2.4) 8(1.2,-2.4) 9(1.2,-1.6) 10(1.2,-0.8) 11(1.2,0) 12(1.2,0.8) 13(1.2,1.6) 14(1.2,2.4)
OSC-SMD_L3.2-W1.5
  rect 1.05x1.7 smd: 1(-1.275,0) 2(1.275,0)
Pad_e73
  round 3.8 hole 2.2: (0,0)
Pad_e74
  round 0.3 hole 2.2x0.3: (0,0)
Pad_e75
  round 0.3 hole 0.3: (0,0)
Pad_e76
  round 0.3 hole 0.3: (0,0)
Pad_e77
  round 0.3 hole 0.3: (0,0)
Pad_e78
  round 0.3 hole 0.3: (0,0)
Pad_e79
  round 0.3 hole 0.3: (0,0)
Pad_e80
  round 0.3 hole 0.3: (0,0)
Pad_e81
  round 0.3 hole 0.3: (0,0)
Pad_e82
  round 0.3 hole 0.3: (0,0)
Pad_e83
  round 0.3 hole 0.3: (0,0)
Pad_e84
  round 0.3 hole 0.3: (0,0)
Pad_e85
  round 3.8 hole 2.2: (0,0)
Pad_e86
  round 0.3 hole 0.3: (0,0)
Pad_e87
  round 0.3 hole 0.3: (0,0)
Pad_e88
  round 0.3 hole 0.3: (0,0)
Pad_e89
  round 0.3 hole 0.3: (0,0)
Pad_e90
  round 0.3 hole 0.3: (0,0)
Pad_e91
  round 0.3 hole 0.3: (0,0)
Pad_e92
  round 0.3 hole 0.3: (0,0)
Pad_e93
  round 0.3 hole 0.3: (0,0)
Pad_e94
  round 3.8 hole 2.2: (0,0)
Pad_e95
  round 0.3 hole 0.3: (0,0)
Pad_e96
  round 0.3 hole 0.3: (0,0)
Pad_e97
  round 0.3 hole 0.3: (0,0)
Pad_e98
  round 0.3 hole 0.3: (0,0)
Pad_e99
  round 0.3 hole 0.3: (0,0)
Pad_e100
  round 0.3 hole 0.3: (0,0)
Pad_e101
  round 0.3 hole 0.3: (0,0)
Pad_e102
  round 0.3 hole 0.3: (0,0)
Pad_e103
  round 3.8 hole 2.2: (0,0)
Pad_e104
  round 0.3 hole 0.3: (0,0)
Pad_e105
  round 0.3 hole 0.3: (0,0)
Pad_e106
  round 0.3 hole 0.3: (0,0)
Pad_e107
  round 0.3 hole 0.3: (0,0)
Pad_e108
  round 0.3 hole 0.3: (0,0)
Pad_e109
  oval 2x3 smd far side: 1(0,0)
Pad_e110
  oval 2x3 smd far side: 1(0,0)
Pad_e111
  oval 2x3 smd far side: 1(0,0)
Pad_e112
  oval 2x3 smd far side: 1(0,0)
QFN-40_L5.0-W5.0-P0.40-TL-EP3.4
  oval 0.8x0.201 smd: 1(-2.499,1.801) 2(-2.499,1.399) 3(-2.499,1.001) 4(-2.499,0.6) 5(-2.499,0.201) 6(-2.499,-0.201) 7(-2.499,-0.6) 8(-2.499,-1.001) 9(-2.499,-1.399) 10(-2.499,-1.801) 21(2.499,-1.801) 22(2.499,-1.399) 23(2.499,-1.001) 24(2.499,-0.6) 25(2.499,-0.201) 26(2.499,0.201) 27(2.499,0.6) 28(2.499,1.001) 29(2.499,1.399) 30(2.499,1.801)
  oval 0.201x0.8 smd: 11(-1.801,-2.499) 12(-1.399,-2.499) 13(-1.001,-2.499) 14(-0.6,-2.499) 15(-0.201,-2.499) 16(0.201,-2.499) 17(0.6,-2.499) 18(1.001,-2.499) 19(1.399,-2.499) 20(1.801,-2.499) 31(1.801,2.499) 32(1.399,2.499) 33(1.001,2.499) 34(0.6,2.499) 35(0.201,2.499) 36(-0.201,2.499) 37(-0.6,2.499) 38(-1.001,2.499) 39(-1.399,2.499) 40(-1.801,2.499)
  rect 3.401x3.401 smd: 41(0,0)
R0402
  rect 0.566x0.54 smd: 1(-0.433,0) 2(0.433,0)
R0402#2
  rrect 0.566x0.54 smd: 1(-0.433,0) 2(0.433,0)
SOIC-8_L5.2-W5.2-P1.27-LS7.9-BL
  oval 0.63x2.25 smd: 1(-1.905,-3.53) 2(-0.635,-3.53) 3(0.635,-3.53) 4(1.905,-3.53) 5(1.905,3.53) 6(0.635,3.53) 7(-0.635,3.53) 8(-1.905,3.53)
SOP-8_L4.9-W3.9-P1.27-LS6.0-BL
  oval 0.63x1.865 smd: 1(-1.905,-2.683) 2(-0.635,-2.683) 3(0.635,-2.683) 4(1.905,-2.683) 5(1.905,2.683) 6(0.635,2.683) 7(-0.635,2.683) 8(-1.905,2.683)
SOT-23-3_L2.9-W1.3-P1.90-LS2.3-BR
  rect 1.07x0.532 smd: 1(0.99,-0.95) 2(0.99,0.95) 3(-0.99,0)
SW-SMD_L3.9-W3.0-P4.45
  rect 1.23x1.36 smd: 1(-2.185,0) 2(2.185,0)
TQFN-16_L3.0-W3.0-P0.50-BL-EP1.5
  rect 0.25x0.6 smd: 1(-0.749,-1.5) 2(-0.248,-1.5) 3(0.252,-1.5) 4(0.751,-1.5) 9(0.75,1.5) 10(0.25,1.5) 11(-0.25,1.5) 12(-0.749,1.5)
  rect 0.6x0.25 smd: 5(1.5,-0.748) 6(1.5,-0.248) 7(1.5,0.252) 8(1.5,0.752) 13(-1.5,0.752) 14(-1.5,0.252) 15(-1.5,-0.248) 16(-1.5,-0.748)
  rect 1.5x1.5 smd: 17(0,0)
UFQFPN-48_L7.0-W7.0-P0.50-BL-EP5.6
  oval 0.28x0.9 smd: 1(-2.751,-3.547) 2(-2.251,-3.547) 3(-1.75,-3.547) 4(-1.25,-3.547) 5(-0.75,-3.547) 6(-0.249,-3.547) 7(0.249,-3.547) 8(0.75,-3.547) 9(1.25,-3.547) 10(1.75,-3.547) 11(2.251,-3.547) 12(2.751,-3.547) 25(2.751,3.547) 26(2.251,3.547) 27(1.75,3.547) 28(1.25,3.547) 29(0.75,3.547) 30(0.249,3.547) 31(-0.249,3.547) 32(-0.75,3.547) 33(-1.25,3.547) 34(-1.75,3.547) 35(-2.251,3.547) 36(-2.751,3.547)
  oval 0.9x0.28 smd: 13(3.547,-2.75) 14(3.547,-2.25) 15(3.547,-1.75) 16(3.547,-1.25) 17(3.547,-0.75) 18(3.547,-0.25) 19(3.547,0.25) 20(3.547,0.75) 21(3.547,1.25) 22(3.547,1.75) 23(3.547,2.25) 24(3.547,2.75) 37(-3.547,2.751) 38(-3.547,2.251) 39(-3.547,1.75) 40(-3.547,1.25) 41(-3.547,0.75) 42(-3.547,0.249) 43(-3.547,-0.249) 44(-3.547,-0.75) 45(-3.547,-1.25) 46(-3.547,-1.75) 47(-3.547,-2.251) 48(-3.547,-2.751)
  rect 5.6x5.6 smd: 49(0,0)
USB-C-SMD_TYPE-C-6PIN-2MD-073
  rect 0.6x1.1 smd: 1(-3.2,2.375) 2(-2.4,2.375) 11(2.4,2.375) 12(3.2,2.375)
  rect 0.3x1.1 smd: 3(-1.75,2.375) 4(-1.25,2.375) 5(-0.75,2.375) 6(-0.25,2.375) 7(0.25,2.375) 8(0.75,2.375) 9(1.25,2.375) 10(1.75,2.375)
  oval 1.2x1.8 hole 0.6x1.2: 13(-4.325,-2.375) 14(4.325,-2.375)
  oval 1.2x2 hole 0.6x1.5: 13(-4.325,1.825) 14(4.325,1.825)

## Nets
As in the schematic, except:
GND: C1.1 C2.1 C3.2 C4.1 C5.1 C6.1 C7.1 C8.1 C9.1 C10.1 C11.2 C12.1 C13.2 C14.1 C15.1 C16.1 C17.1 C18.1 C19.1 C20.1 C21.1 C22.2 C23.1 C24.1 C25.1 C26.1 C27.1 C28.1 C29.1 C30.1 C31.2 C32.2 C33.1 C34.1 CN2.1 H1.4 NOREF#6.1 PA0.2 PA0.4 PWR ON.2 PWR ON.4 Q1.2 R2.1 R3.2 R5.1 R9.1 R11.1 R12.1 RST1.2 TTL1.1 TTL1.12 TTL1.13 TTL1.14 U1.8 U1.23 U1.35 U1.47 U1.49 U2.3 U2.11 U2.15 U2.17 U3.3 U3.41 U4.4 U5.3 U6.4 U6.12 X1.2 X1.4 X3.1 X3.5 X3.6 X3.12 X3.18 X3.19 X3.20
VDD3V3: C3.1 C6.2 C7.2 C8.2 C9.2 C10.2 C11.1 C21.2 C24.2 C26.2 C27.2 C29.2 C33.2 C34.2 H1.1 L1.2 NOREF#32.1 R4.2 R13.1 R14.1 U1.1 U1.9 U1.24 U1.36 U1.48 U3.21 U4.3 U4.7 U4.8 U6.9 U6.10 X3.3 X3.4 X3.17
KEY1: PA0.1 PA0.3 U1.10
PA13: H1.2 NOREF#18.1 U1.34
PA14: H1.3 NOREF#29.1 U1.37
$1N8600: PWR ON.1 PWR ON.3 R7.1

Pads without a net: TTL1 3 9; U2 5 6 12 13; U3 4 5 6 7 8 9 10 11 12 13 14 20 24 25 26 27 32 35; U5 4; U6 1 5 6 7 8 14

## Via types
v1: diameter 0.5, hole 0.305, Top Layer to Bottom Layer, 71 vias
v2: diameter 0.61, hole 0.305, Top Layer to Bottom Layer, 1 via

## Routing (per net, layer and track width the routed paths; a pad name or vN(x,y) marks a point on that pad's centre or on a via; arc(x,y) is an arc through that point)
AVDD3V3: length 31.1
  Top Layer w0.17: U3.18 9.33,5.27
  Top Layer w0.3: C23.2 10.12,3.97 10.54,3.55 v1(10.54,2.79) ; U2.8 U2.7 25.04,6.22 24,6.22 23.75,6.47 C14.2 23.68,7.23 v1(21.59,7.23) 21.59,9.9 22.1,10.41 25.86,10.41 R6.1
  Top Layer w0.4: 9.4,5.2 9.65,4.95 C23.2
  SIG w0.3: v1(10.54,2.79) 10.54,6.6 11.18,7.23 v1(21.59,7.23)
GND: length 46.9
  Top Layer w0.17: v1(26.67,6.6) 26.92,6.35 U2.11 ; v1(26.67,6.6) 26.42,6.85 U2.3 ; v1(26.67,6.6) 27.42,6.6 27.67,6.85 28.16,6.85 U2.15 ; v1(6.98,9.74) 6.66,9.42 5.83,9.42 ; X3.12 15.26,23.91 v1(15.42,23.74) ; v1(17.37,23.74) 18.26,24.63 X3.6 X3.5 18.76,25.94 19.05,25.65 19.5,25.65 19.52,25.67 20.43,25.67 20.65,25.89 20.65,26.62 X3.1
  Bottom Layer w0.17: X1.2 15.54,28.4 C1.1 ; v1(13.72,19.81) 13.72,18.79 13.5,18.58 13.5,18.24 U1.35 ; U1.47 13.68,23.91 v1(13.84,23.74) ; U1.23 19.16,19.43 18.82,19.43 18.44,19.81 v1(17.27,19.81) ; U1.8 16.38,24.7 v1(15.42,23.74)
  Bottom Layer w0.3: C2.1 18.58,28.1 18.92,28.44 18.92,32 18.67,32.25 14.6,32.25 v1(13.73,31.38) 13.27,30.92 v1(11.52,30.92) 9.59,30.92 v1(9.27,30.6) 9.27,29.71 9.78,29.21 9.78,27.43 8.74,26.38 C7.1
  vias: v1(6.99,7.2) v1(9.25,9.87) v1(9.52,8.76) v1(9.52,7.87) v1(10.89,24.24) v1(12.06,27.9) v1(12.95,12.95) v1(13.72,21.2) v1(13.84,22.47) v1(15.4,22.47) v1(15.42,21.2) v1(15.37,19.68) v1(17.35,21.03) v1(17.37,22.47) v1(19.82,28.62) v1(21.84,32.25) v1(23,28.75) v1(24.64,9.39) v1(24.76,19.81)
VBAT: length 13.5
  Top Layer w0.17: C18.2 10.16,12.06 9.91,11.81 9.52,11.81 9.33,11.61 9.33,10.92
  Top Layer w0.5: C18.2 10.53,12.34 v1(10.76,12.57)
  SIG w0.5: CN2.2 10.15,16.01 10.76,15.4 v1(10.76,12.57)
VBUS: length 40.1
  Top Layer w0.17: 7.73,10.92 7.73,12.23 C19.2
  Top Layer w0.3: C19.2 7.54,12.34 7.44,12.24 6.84,12.84 v1(6.84,13.2)
  Bottom Layer w0.17: TTL1.2 18.86,5.78 18.76,5.68 18.76,4.66 ; 14.22,4.57 14.22,5.93 TTL1.11
  Bottom Layer w0.5: 14.31,4.25 14.22,4.33 14.22,4.57 ; 14.31,4.25 18.35,4.25 18.67,4.57 ; 14.31,4.25 14.16,4.25 13.59,3.68 5.84,3.68 3.56,5.96 1.91,5.96 0.76,7.11 0.76,11.81 2.16,13.2 v1(6.84,13.2) 8.09,13.2 C30.2 8.1,11.85 U5.5
VDD3V3: length 146.5
  Top Layer w0.17: 10.83,6.35 10.8,6.37 10.8,6.62 U3.21 ; C3.1 19.26,29.59 X3.4 X3.3 ; X3.17 12.76,25.71 12.32,25.27 12.1,25.27
  Top Layer w0.3: C3.1 18.45,29.68 18.29,29.84 18.29,31.62 18.8,32.13 v1(19.69,32.13) ; 12.1,25.27 11.3,25.27 10.41,26.16 v1(9.83,26.16) ; v1(6.35,36) C34.2
  Top Layer w0.5: 10.83,6.35 10.83,4.16 11.56,3.42 15.11,3.42 16.21,4.53 L1.2 16.43,7.96 C26.2 C27.2 16.58,12.23 C29.2 16.58,14.14 v1(16.38,14.35)
  SIG w0.3: v1(9.83,26.16) 9.14,26.16 8.76,25.78 ; 8.76,25.78 8.76,26.79 7.49,28.06 6.22,28.06 H1.1 5.84,30.48 6.35,30.98 6.35,32.21 ; 8.76,25.78 8.76,21.97 8.51,21.71 v1(7.75,21.71) 8.38,21.08 8.38,19.81 v1(7.87,19.3) 7.75,19.17 7.75,17.65 8.38,17.01 10.67,17.01 v1(12.7,14.98) 13.33,14.35 v1(16.38,14.35) 16.38,16.12 16.89,16.63 18.54,16.63 20.43,18.52 v1(20.57,18.52) 25.8,18.52 26.67,17.65 v1(26.67,12.96) ; 6.35,32.21 19.6,32.21 v1(19.69,32.13) ; 6.35,32.21 v1(6.35,34.54)
  Bottom Layer w0.17: U1.9 16.88,26.27 17.22,26.61 19.98,26.61 20.39,26.2 20.41,26.2 20.45,26.16 22.73,26.16 22.99,26.41 22.99,26.59 22.74,26.83 ; R14.1 8.58,20.01 v1(7.87,19.3) ; R13.1 v1(7.75,21.71) ; 21.73,28.42 v1(21.57,28.57) ; U1.24 19.8,18.91 20.12,19.22
  Bottom Layer w0.3: v1(6.35,34.54) v1(6.35,36) ; U1.1 12.67,25 12.08,25 ; R4.2 21.73,28.42 ; 21.59,29.21 21.84,29.46 23.24,29.46 23.62,29.08 23.62,27.05 23.41,26.83 C11.1 ; 21.59,29.21 21.59,28.59 v1(21.57,28.57) ; 21.59,29.21 21.34,29.46 21.34,31.87 21.08,32.13 v1(19.69,32.13) ; v1(12.7,14.98) 12.86,15.15 C9.2 12.88,15.63 U1.36 ; U4.3 27.9,12.96 v1(26.67,12.96) ; 12.08,25 U1.48 ; 12.08,25 11.39,25.69 10.91,25.69 10.45,26.16 v1(9.83,26.16) C7.2 9.83,24.47 C6.2 ; C34.2 7.71,36.01 C33.2 9.83,35.98 10.34,36.5 10.34,37.01 11.14,37.01
  Bottom Layer w0.5: C24.2 21.54,19.48 ; C24.2 v1(20.57,18.52) ; C24.2 C21.2 21.54,17.22 20.83,16.51 20.83,14.25 21.11,13.97 ; 21.54,19.48 21.56,19.5 ; 21.54,19.48 20.35,19.48 20.12,19.25 20.12,19.22 ; 5.78,28.42 2.41,28.42
(no net): length 0.3
  Top Layer w0.254: 31.64,37.19 31.64,37.16 31.68,37.13 ; 31.68,2.84 31.64,2.87 31.64,2.9 ; 4.63,2.84 4.59,2.87 4.59,2.9 ; 4.63,37.13 4.59,37.16 4.59,37.19
BOOT0: length 2.9
  Bottom Layer w0.17: R3.1 10.54,23.11 11.24,22.41 U1.44
D+: length 26
  Bottom Layer w0.124: U5.1 2.91,8 3.42,8.5 4.44,8.5 4.98,7.97 4.98,5.55 5.81,4.73 10.32,4.73 10.92,5.33 10.92,9.01 11.18,9.27 15.62,9.27 15.8,9.09 15.8,6.92 15.71,6.83 15.71,5.4 15.91,5.2 16.51,5.2 16.71,5.4 16.71,6.22
D-: length 25.9
  Bottom Layer w0.124: U5.2 2.91,9.27 3.35,8.83 4.58,8.83 5.31,8.1 5.31,5.69 5.95,5.05 10.18,5.05 10.59,5.46 10.59,9.15 11.04,9.59 15.76,9.59 16.12,9.23 16.12,6.92 16.21,6.83 ; 16.21,6.83 16.21,7.06 16.38,7.23 17.02,7.23 17.21,7.04 17.21,6.22 ; 16.21,6.83 16.21,6.22
F_CS: length 15
  Bottom Layer w0.17: U1.20 19.9,20.91 20.57,21.59 25.4,21.59 26.03,20.95 26.03,15.62 26.42,15.24 U4.1
HEART_IRQ: length 30.2
  Top Layer w0.17: v1(9.14,27.81) 8.89,27.55 8.89,22.86 9.29,22.46 9.29,20.93 10.29,19.93 v1(10.29,18.28)
  Bottom Layer w0.17: v1(10.29,18.28) 10.29,18.41 11.29,19.41 U1.38 ; 13.54,37.01 13.46,37.09 13.46,37.63 13.8,37.97 14.6,37.97 14.86,37.71 14.86,33.4 13.84,32.38 9.14,32.38 8.76,32 8.76,28.19 v1(9.14,27.81)
I2C1_SCL: length 45.3
  Top Layer w0.17: X3.13 14.73,26.76 14.73,29.08 13.86,29.95 v1(8.25,29.95) 8.18,29.95 7.26,29.03 7.26,21.25 7.56,20.95 v1(7.73,20.95) 7.73,20.55 6.73,19.55 6.73,15.36 5.46,14.09 5.46,12.44 6.53,11.38 6.53,10.92
  Bottom Layer w0.17: v1(8.25,29.95) 8.25,32.63 8.51,32.89 12.95,32.89 13.54,33.47 U6.2 ; v1(7.73,20.95) 9.27,20.95 9.45,20.77 R14.2 9.91,20.44 10.03,20.57 10.03,21.2 10.24,21.41 U1.42
I2C1_SDA: length 43.8
  Top Layer w0.17: X3.14 14.22,26.77 14.22,28.7 13.59,29.33 8.25,29.33 v1(7.75,28.82) v1(7.75,22.42) 8.01,22.42 8.25,22.18 8.25,20.44 7.11,19.3 7.11,15.28 5.97,14.14 5.97,12.44 6.94,11.47 6.94,10.93 6.93,10.92
  Bottom Layer w0.17: U6.3 12.74,33.82 12.45,33.52 8.25,33.52 7.75,33.02 v1(7.75,28.82) ; v1(7.75,22.42) 9.2,22.42 9.45,22.17 R13.2 10.16,21.71 10.36,21.91 U1.43
I2S4_BCLK: length 21
  Top Layer w0.17: U2.16 28.18,7.36 28.83,7.36 29.06,7.6 29.06,10.81 27.78,12.09 21.18,12.09 19.81,13.46 19.81,16.36 v1(19.83,16.38)
  Bottom Layer w0.17: U1.26 17.88,16.66 18.16,16.38 v1(19.83,16.38)
I2S4_DIN: length 29
  Top Layer w0.17: v1(19.94,24.9) 19.94,17.65 19.18,16.89 19.18,12.44 19.94,11.68 27.69,11.68 28.45,10.92 28.45,9.68 27.43,8.67 27.43,8.11 U2.1
  Bottom Layer w0.17: U1.11 17.88,25.75 18.03,25.9 18.93,25.9 v1(19.94,24.9)
I2S4_LRCK: length 22.2
  Top Layer w0.17: U2.14 28.17,6.35 28.83,6.35 29.45,6.96 29.45,10.97 27.94,12.47 21.34,12.47 20.32,13.49 v1(20.32,17.14)
  Bottom Layer w0.17: U1.25 18.38,17.3 18.54,17.14 v1(20.32,17.14)
KEY1: length 20.6
  Top Layer w0.17: v1(23.5,25.65) 27.81,25.65 28.83,26.67 28.83,30.73 29.34,31.24 30.59,31.24 PA0.3 PA0.1
  Bottom Layer w0.17: U1.10 17.38,25.89 17.78,26.28 19.56,26.28 20.19,25.65 v1(23.5,25.65)
LCD_BL: length 3.1
  Top Layer w0.17: R1.2 20.32,26.79 X3.2
LCD_BLK: length 12.1
  Top Layer w0.17: 23.72,29.65 25.14,29.65 R2.2 v2(25.15,28.7)
  Bottom Layer w0.17: v2(25.15,28.7) 24.76,28.7 24.02,27.95 24.02,24.65 23.78,24.41 U1.13
LCD_CS: length 29.5
  Top Layer w0.17: X3.8 17.25,26.75 v1(17.25,32.89)
  Bottom Layer w0.17: U1.14 23.91,23.91 26.42,26.41 26.42,31.87 25.4,32.89 v1(17.25,32.89)
LCD_DC: length 33.5
  Top Layer w0.17: v1(17.75,34.06) 17.75,26.74 X3.7
  Bottom Layer w0.17: U1.16 24.19,22.91 27.43,26.16 27.43,32.13 25.39,34.17 17.86,34.17 v1(17.75,34.06)
LCD_RST: length 39.1
  Top Layer w0.17: X3.11 15.75,26.75 v1(15.75,34.41)
  Bottom Layer w0.17: U1.18 24.45,21.91 28.32,25.78 28.32,32.51 25.76,35.07 16.4,35.07 v1(15.75,34.41)
OSC32IN: length 7.9
  Bottom Layer w0.17: 11.21,30.09 11.05,29.93 11.05,28.45 X2.1 10.79,28.18 10.79,26.28 11.05,26.03 13.72,26.03 13.88,25.87 U1.3
OSC32OUT: length 6
  Bottom Layer w0.17: C5.2 12.54,29.62 13.34,28.82 X2.2 13.33,28.18 13.33,26.67 13.59,26.41 14.1,26.41 14.38,26.13 U1.4
OSC_IN: length 7.3
  Bottom Layer w0.17: U1.5 15,25.33 15,26.56 16.51,28.06 16.51,30.73 16.38,30.86 15.54,30.86 15.52,30.88
OSC_OUT: length 5.8
  Bottom Layer w0.17: 17.72,29.18 17.72,27.47 17.41,27.16 15.99,27.16 15.38,26.55 U1.6
PA5: length 32.5
  Top Layer w0.17: v1(16.78,33.61) 16.76,33.59 X3.9
  Bottom Layer w0.17: U1.15 24.18,23.41 26.92,26.16 26.92,32.13 25.48,33.57 16.83,33.57 v1(16.78,33.61)
PA7: length 36.6
  Top Layer w0.17: X3.10 16.26,26.74 v1(16.26,32.89)
  Bottom Layer w0.17: U1.17 24.32,22.41 27.81,25.9 27.81,32.38 25.58,34.62 16.84,34.62 16.26,34.03 v1(16.26,32.89)
PA9: length 15.8
  Bottom Layer w0.17: U1.30 15.88,18.11 15.88,10.66 15.37,10.16 10.41,10.16 9.52,9.27 U5.7
PA10: length 14.5
  Bottom Layer w0.17: U1.31 15.38,11.06 14.86,10.54 U5.6
PA13: length 31.7
  Bottom Layer w0.17: 5.95,25.93 2.06,25.93 0.76,24.63 0.76,15.62 1.91,14.47 13.46,14.47 13.88,14.89 U1.34
PA14: length 14
  Bottom Layer w0.17: 5.95,23.39 7.24,22.1 7.24,18.79 8.25,17.78 11.3,17.78 12.08,18.56 U1.37 ; H1.3 2.92,23.36
PB3: length 13.1
  Top Layer w0.17: v1(8.35,18.5) 7.62,17.78 7.62,15.24 6.35,13.97 6.35,12.57 7.33,11.59 7.33,10.92
  Bottom Layer w0.17: U1.39 11.15,19.91 10.94,19.7 10.94,19.69 9.75,18.5 v1(8.35,18.5)
PB4: length 21.1
  Top Layer w0.17: v1(8.86,19.4) 8.86,20.35 8.64,20.57 8.64,22.22 8.13,22.73 8.13,28.44 8.64,28.95 13.21,28.95 13.72,28.44 13.72,26.78 X3.15
  Bottom Layer w0.17: v1(8.86,19.4) 9.17,19.4 9.4,19.17 10.03,19.17 10.67,19.81 10.67,20.19 10.89,20.41 U1.40
PB5: length 18.6
  Top Layer w0.17: X3.16 13.26,28.14 12.83,28.57 9.02,28.57 8.51,28.06 8.51,22.86 9.02,22.35 9.02,20.7 9.51,20.21 v1(9.51,19.77)
  Bottom Layer w0.17: U1.41 10.63,20.91 10.3,20.59 10.3,20.02 10.09,19.81 9.54,19.81 v1(9.51,19.77)
PB10: length 19.3
  Bottom Layer w0.17: U1.21 19.91,20.41 20.7,21.2 25.15,21.2 25.53,20.82 25.53,13.08 25.02,12.57 21.23,12.57 U4.6
PB14: length 17.8
  Bottom Layer w0.17: 28.17,13.97 26.42,13.97 26.16,13.71 26.16,12.95 25.27,12.06 17.91,12.06 17.38,12.59 U1.27
PB15: length 10.6
  Bottom Layer w0.17: U4.5 20.98,11.3 17.65,11.3 16.88,12.07 U1.28
PMIC_PG: length 2.2
  Top Layer w0.17: U3.29 11.6,9.82 12.32,10.54 12.77,10.54
PMIC_PWRON: length 30.6
  Top Layer w0.17: v1(24.76,16.76) 26.03,16.76 27.05,17.78 27.05,18.92 27.43,19.3 C17.2 31.02,19.16 R7.2 ; 10.83,10.22 11.49,10.22 11.68,10.41 11.68,11.04 12.45,11.81 14.22,11.81 14.68,12.26 14.68,14.46 15.58,15.36 v1(18.16,15.36)
  Bottom Layer w0.17: v1(18.16,15.36) 19.75,13.78 19.75,13.74 20.07,13.41 20.11,13.41 20.19,13.33 22.99,13.33 23.24,13.58 23.24,16.28 23.72,16.76 v1(24.76,16.76)
PMIC_TS: length 2.8
  Top Layer w0.17: 10.13,10.92 11.18,10.92 11.41,11.15 11.41,11.16 11.43,11.17 R9.2
RST: length 58.6
  Top Layer w0.17: 5.36,32.89 6.73,32.89 8.74,34.9 21.86,34.9 22.51,34.25 22.51,30.24 22.22,29.95 v1(22.22,28.7) 22.22,25.9 21.72,25.4 19.63,25.4 19.3,25.07 19.3,18.03 18.8,17.52 18.8,15.15 18.48,14.83 15.73,14.83 15.11,14.22 15.11,11.04 14.6,10.54 R10.2
  Bottom Layer w0.17: v1(22.22,28.7) 22.22,28.04 22.23,28.03 22.23,27.33 22.22,27.32 22.22,27.05 21.99,26.82 20.73,26.82 C12.2 20.66,26.88 16.35,26.88 15.88,26.42 U1.7
VRTC: length 61.9
  Top Layer w0.17: v1(12.59,8.76) 12.73,8.89 C20.2 12.7,9.42 10.83,9.42
  SIG w0.3: v1(18.8,37.71) 24.64,37.71 27.94,34.41 27.94,9.77 26.92,8.76 v1(12.59,8.76)
  Bottom Layer w0.3: 11.94,37.01 11.94,37.97 12.45,38.48 15.11,38.48 15.84,37.75 C32.1 ; C31.1 18.76,37.75 v1(18.8,37.71)
  Bottom Layer w0.4: C31.1 C32.1
VSYS: length 34.9
  Top Layer w0.17: 8.76,5.08 8.93,5.24 U3.17 ; v1(11.81,8.25) 11.56,8 11.56,7.62 11.36,7.42 U3.23 ; 8.93,10.92 8.93,12.3 C25.2 ; v1(9.49,12.31) 9.46,12.34 C25.2 ; C25.2 8.89,12.06 8.13,11.3 8.13,10.92 8.13,10.92
  Top Layer w0.5: R8.1 1.88,10.13 v1(1.65,9.9) ; 8.76,5.08 8,4.31 C22.1 7.24,3.97 6.98,3.72 v1(6.98,2.92)
  SIG w0.5: v1(6.98,2.92) 8.64,2.92 9.78,4.06 9.78,6.98 10.79,8 11.56,8 v1(11.81,8.25) 11.81,9.99 v1(9.49,12.31) 1.91,12.31 1.65,12.06 v1(1.65,9.9)
$1N3644: length 1.2
  Bottom Layer w0.17: C28.2 8.14,7.03 U5.8
$1N3653: length 2.8
  Bottom Layer w0.17: R11.2 17.91,8 17.78,7.87 17.78,6.16 TTL1.4
$1N3654: length 2.5
  Bottom Layer w0.17: R12.2 14.6,8 14.71,7.89 TTL1.10
$1N3730: length 1.5
  Top Layer w0.17: 26.92,9.6 26.92,8.1 U2.2
$1N3744: length 7.5
  Top Layer w0.17: CN1.1 24.77,1.77 24.76,1.76 24.76,1.65 25.15,1.27 26.67,1.27 27.05,1.65 27.05,3.3 26.42,3.93 U2.10
$1N3745: length 2.4
  Top Layer w0.17: U2.9 25.92,2.89 CN1.2
$1N3746: length 1.5
  Top Layer w0.17: U2.4 25.91,8.11 25.91,9.6
$1N3823: length 2.6
  Bottom Layer w0.17: U1.22 19.91,19.91 20.45,20.44 21.49,20.44 21.56,20.52
$1N4450: length 1.4
  Top Layer w0.17: R1.1 21.69,30.65 Q1.3
$1N5317: length 2.5
  Top Layer w0.17: LED1.1 3.58,10.22 5.83,10.22
$1N5318: length 1.6
  Top Layer w0.17: R8.2 3.33,12.07 LED1.2
$1N5323: length 3.3
  Top Layer w0.17: U3.2 4.49,9.82 4.19,9.52 4.19,9.01 3.94,8.76 C16.2
$1N5350: length 3.2
  Top Layer w0.17: U3.22 11.47,7.02
  Top Layer w0.3: 11.47,7.02 12.19,7.74 L1.1
$1N8600: length 3.5
  Top Layer w0.17: PWR ON.3 PWR ON.1 31.89,16.58 R7.1

## Copper pours and planes (outline as drawn; the poured copper is in the pictures)
GND on Top Layer: -5.59,43.56 39.5,43.56 39.5,-6.1 -5.59,-6.1
GND on Bottom Layer: -5.72,44.45 39.37,44.45 39.37,-5.21 -5.72,-5.21
GND on SIG: -4.7,44.83 40.39,44.83 40.39,-4.83 -4.7,-4.83
GND on GND: -5.08,42.92 40,42.92 40,-6.74 -5.08,-6.74

## Text on the board
Bottom Silkscreen Layer: 2025.10 | hand watch v1.0 | Author: myry | +
